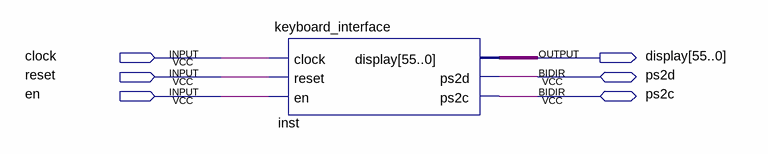
[diagram p0: schematic sheet]
// Quartus schematic Block1.bdf as structural Verilog: 1 symbols, 6 pins
module Block1 (
  input  clock,
  input  reset,
  input  en,
  inout  ps2d,
  inout  ps2c,
  output [55:0] display
);

  keyboard_interface inst (.clock(clock), .reset(reset), .en(en), .display(display), .ps2d(ps2d), .ps2c(ps2c));
endmodule
